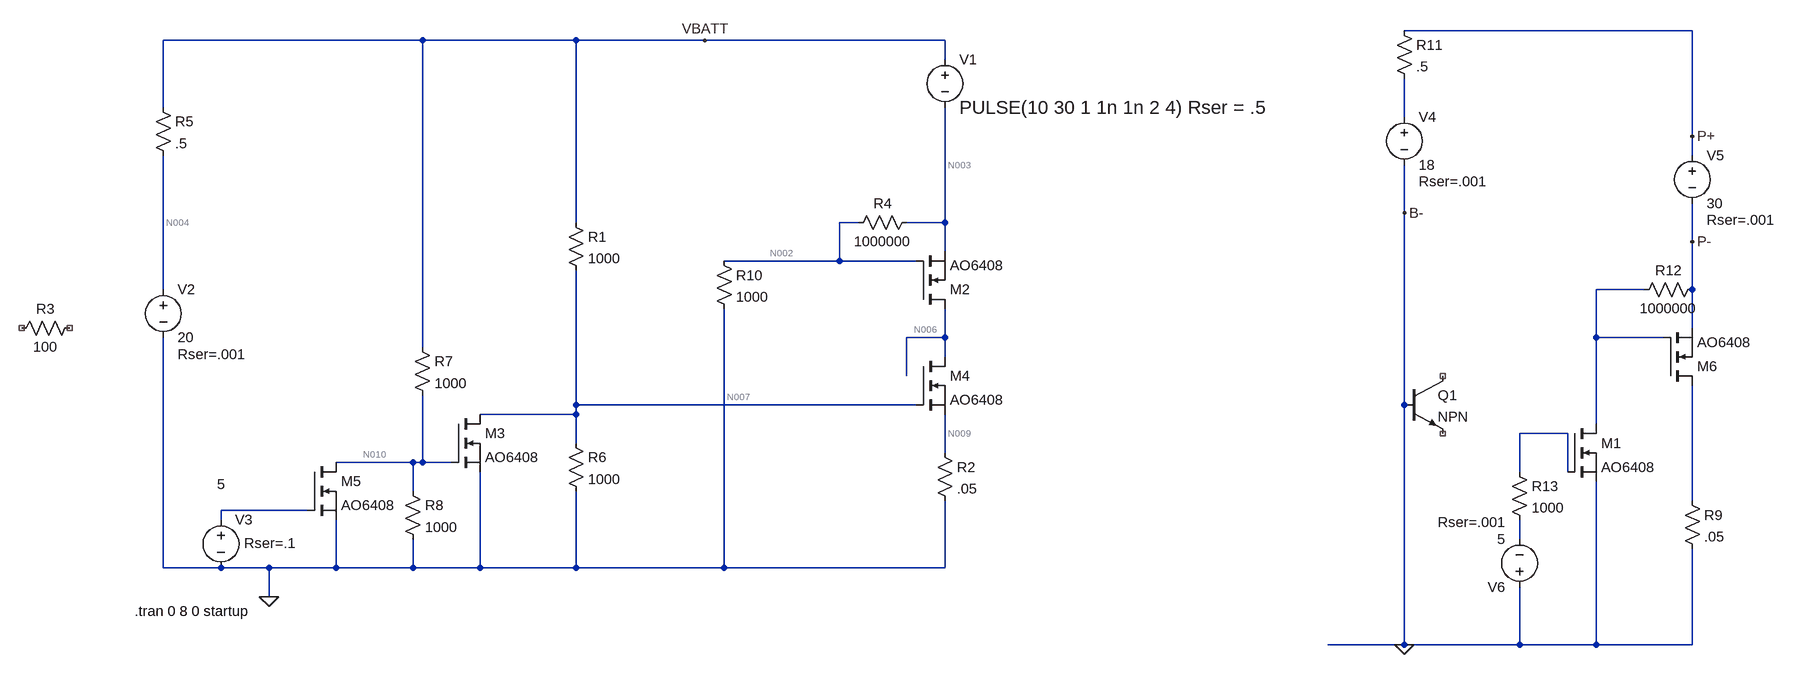
[diagram p0: schematic BmsProtection.asc]
BmsProtection.asc, the LTspice schematic file:
Version 4
SHEET 1 3028 680
WIRE 2880 -656 2400 -656
WIRE 48 -640 -384 -640
WIRE 304 -640 48 -640
WIRE 544 -640 304 -640
WIRE 944 -640 544 -640
WIRE 944 -608 944 -640
WIRE -384 -528 -384 -640
WIRE 2400 -512 2400 -576
WIRE 2880 -480 2880 -656
WIRE 2880 -448 2880 -480
WIRE 2400 -352 2400 -432
WIRE 304 -336 304 -640
WIRE 800 -336 768 -336
WIRE 944 -336 944 -528
WIRE 944 -336 880 -336
WIRE 2880 -304 2880 -368
WIRE 944 -288 944 -336
WIRE 768 -272 768 -336
WIRE 768 -272 576 -272
WIRE 896 -272 768 -272
WIRE -384 -224 -384 -448
WIRE 2800 -224 2720 -224
WIRE 2880 -224 2880 -304
WIRE 2880 -160 2880 -224
WIRE 944 -144 944 -192
WIRE 944 -144 880 -144
WIRE 2720 -144 2720 -224
WIRE 2832 -144 2720 -144
WIRE 48 -128 48 -640
WIRE 944 -112 944 -144
WIRE 880 -80 880 -144
WIRE 304 -32 304 -256
WIRE 896 -32 304 -32
WIRE 2400 -32 2400 -352
WIRE 304 -16 304 -32
WIRE 304 -16 144 -16
WIRE 2720 0 2720 -144
WIRE 2672 16 2592 16
WIRE 304 32 304 -16
WIRE 944 48 944 -16
WIRE 32 64 -96 64
WIRE 48 64 48 -48
WIRE 48 64 32 64
WIRE 96 64 48 64
WIRE 2592 80 2592 16
WIRE 2672 80 2672 16
WIRE 32 112 32 64
WIRE 2880 128 2880 -64
WIRE -144 144 -288 144
WIRE -288 160 -288 144
WIRE 2592 192 2592 160
WIRE -384 240 -384 -144
WIRE -288 240 -384 240
WIRE -208 240 -288 240
WIRE -96 240 -96 160
WIRE -96 240 -208 240
WIRE 32 240 32 192
WIRE 32 240 -96 240
WIRE 144 240 144 80
WIRE 144 240 32 240
WIRE 304 240 304 112
WIRE 304 240 144 240
WIRE 576 240 576 -192
WIRE 576 240 304 240
WIRE 944 240 944 128
WIRE 944 240 576 240
WIRE -208 288 -208 240
WIRE 2400 368 2400 -32
WIRE 2400 368 2272 368
WIRE 2592 368 2592 272
WIRE 2592 368 2400 368
WIRE 2720 368 2720 96
WIRE 2720 368 2592 368
WIRE 2880 368 2880 208
WIRE 2880 368 2720 368
FLAG -208 288 0
FLAG 544 -640 VBATT
FLAG 2400 368 0
FLAG 2880 -304 P-
FLAG 2400 -352 B-
FLAG 2880 -480 P+
SYMBOL voltage 944 -624 R0
WINDOW 123 0 0 Left 0
WINDOW 39 0 0 Left 0
WINDOW 3 24 96 Left 3
SYMATTR Value PULSE(10 30 1 1n 1n 2 4) Rser = .5
SYMATTR InstName V1
SYMBOL res 288 -352 R0
SYMATTR InstName R1
SYMATTR Value 1000
SYMBOL res 928 32 R0
SYMATTR InstName R2
SYMATTR Value .05
SYMBOL voltage -384 -240 R0
WINDOW 123 0 0 Left 0
WINDOW 39 24 124 Left 2
SYMATTR SpiceLine Rser=.001
SYMATTR InstName V2
SYMATTR Value 20
SYMBOL res -576 -176 R90
WINDOW 0 0 56 VBottom 2
WINDOW 3 32 56 VTop 2
SYMATTR InstName R3
SYMATTR Value 100
SYMBOL res -400 -544 R0
SYMATTR InstName R5
SYMATTR Value .5
SYMBOL nmos 896 -112 R0
SYMATTR InstName M4
SYMATTR Value AO6408
SYMBOL nmos 896 -192 M180
SYMATTR InstName M2
SYMATTR Value AO6408
SYMBOL res 288 16 R0
SYMATTR InstName R6
SYMATTR Value 1000
SYMBOL nmos 96 -16 R0
SYMATTR InstName M3
SYMATTR Value AO6408
SYMBOL voltage -288 144 R0
WINDOW 123 0 0 Left 0
WINDOW 39 39 55 Left 2
WINDOW 3 -6 -43 Left 2
SYMATTR SpiceLine Rser=.1
SYMATTR Value 5
SYMATTR InstName V3
SYMBOL nmos -144 64 R0
SYMATTR InstName M5
SYMATTR Value AO6408
SYMBOL res 32 -144 R0
SYMATTR InstName R7
SYMATTR Value 1000
SYMBOL res 16 96 R0
SYMATTR InstName R8
SYMATTR Value 1000
SYMBOL res 896 -352 R90
WINDOW 0 0 56 VBottom 2
WINDOW 3 32 56 VTop 2
SYMATTR InstName R4
SYMATTR Value 1000000
SYMBOL res 560 -288 R0
SYMATTR InstName R10
SYMATTR Value 1000
SYMBOL res 2864 112 R0
SYMATTR InstName R9
SYMATTR Value .05
SYMBOL voltage 2400 -528 R0
WINDOW 123 0 0 Left 0
WINDOW 39 24 124 Left 2
SYMATTR SpiceLine Rser=.001
SYMATTR InstName V4
SYMATTR Value 18
SYMBOL res 2384 -672 R0
SYMATTR InstName R11
SYMATTR Value .5
SYMBOL voltage 2880 -464 R0
WINDOW 123 0 0 Left 0
WINDOW 39 24 124 Left 2
SYMATTR SpiceLine Rser=.001
SYMATTR InstName V5
SYMATTR Value 30
SYMBOL voltage 2592 288 R180
WINDOW 123 0 0 Left 0
WINDOW 39 24 124 Left 2
SYMATTR SpiceLine Rser=.001
SYMATTR InstName V6
SYMATTR Value 5
SYMBOL nmos 2832 -64 M180
SYMATTR InstName M6
SYMATTR Value AO6408
SYMBOL res 2896 -240 R90
WINDOW 0 0 56 VBottom 2
WINDOW 3 32 56 VTop 2
SYMATTR InstName R12
SYMATTR Value 1000000
SYMBOL npn 2400 -80 R0
SYMATTR InstName Q1
SYMBOL res 2576 64 R0
SYMATTR InstName R13
SYMATTR Value 1000
SYMBOL nmos 2672 0 R0
SYMATTR InstName M1
SYMATTR Value AO6408
TEXT -432 312 Left 2 !.tran 0 8 0 startup

The netlist it stands for:
* BmsProtection.asc
V1 VBATT N003 PULSE(10 30 1 1n 1n 2 4) Rser = .5
R1 VBATT N007 1000
R2 N009 0 .05
V2 N004 0 20 Rser=.001
R3 NC_01 NC_02 100
R5 VBATT N004 .5
M4 N006 N007 N009 N009 AO6408
M2 N006 N002 N003 N003 AO6408
R6 N007 0 1000
M3 N007 N010 0 0 AO6408
V3 N012 0 5 Rser=.1
M5 N010 N012 0 0 AO6408
R7 VBATT N010 1000
R8 N010 0 1000
R4 N003 N002 1000000
R10 N002 0 1000
R9 N011 0 .05
V4 N001 0 18 Rser=.001
R11 P+ N001 .5
V5 P+ P- 30 Rser=.001
V6 0 N013 5 Rser=.001
M6 N011 N005 P- P- AO6408
R12 P- N005 1000000
Q1 NC_03 0 NC_04 0 NPN
R13 N008 N013 1000
M1 N005 N008 0 0 AO6408
.model NPN NPN
.model PNP PNP
.lib standard.bjt
.model NMOS NMOS
.model PMOS PMOS
.lib standard.mos
.tran 0 8 0 startup
.backanno
.end

* Results of the author's LTspice run, read from the files saved beside the schematic
* Operating Point, zero values left out:
*   V(vbatt) = 4.251 V
*   V(n003) = -1.502 V
*   V(n007) = 77.67 µV
*   V(n009) = -424.6 mV
*   V(n004) = 8.486 mV
*   V(n006) = -1.142 V
*   V(n002) = -1.501 mV
*   V(n010) = 2.126 V
*   Id(M4) = -8.492 A
*   Is(M4) = 8.492 A
*   Id(M2) = 8.492 A
*   Is(M2) = -8.492 A
*   Id(M3) = 4.251 mA
*   Is(M3) = -4.251 mA
*   Id(M5) = 965.6 pA
*   Is(M5) = -965.6 pA
*   I(R1) = 4.251 mA
*   I(R2) = -8.492 A
*   I(R5) = 8.486 A
*   I(R6) = 77.67 nA
*   I(R7) = 2.126 mA
*   I(R8) = 2.126 mA
*   I(R4) = -1.501 µA
*   I(R10) = -1.501 µA
*   I(V1) = -8.492 A
*   I(V2) = 8.486 A
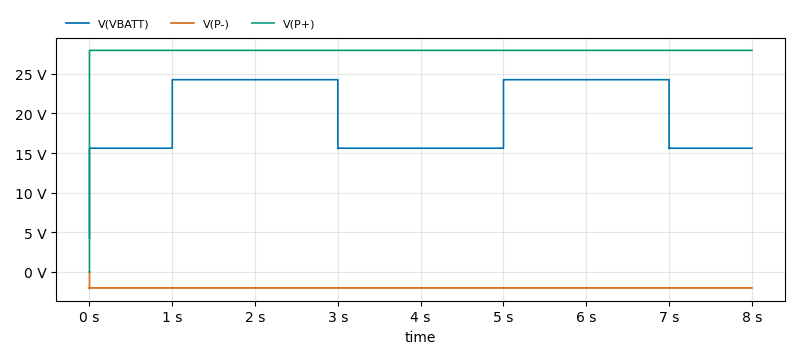
[diagram p1: Transient Analysis of BmsProtection.asc, plotted from the saved traces]
* Transient Analysis, 1 run:
*   V(VBATT): min 4.251 V, max 24.26 V, average 19.94 V, rms 20.4 V, last 15.62 V
*   V(P-): min -2.123 V, max 0 V, average -2.015 V, rms 2.015 V, last -2.015 V
*   V(P+): min 0 V, max 27.96 V, average 27.96 V, rms 27.96 V, last 27.96 V